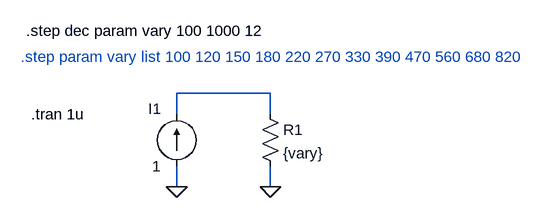
[diagram p0: schematic StepVal.asc]
StepVal.asc, the LTspice schematic file:
Version 4
SHEET 1 1128 680
WIRE -512 320 -512 288
WIRE -512 208 -512 176
WIRE -512 176 -368 176
WIRE -368 176 -368 208
WIRE -368 288 -368 320
FLAG -512 320 0
FLAG -368 320 0
SYMBOL current -512 288 R180
WINDOW 0 24 88 Left 0
WINDOW 3 24 0 Left 0
SYMATTR InstName I1
SYMATTR Value 1
SYMBOL res -384 192 R0
SYMATTR InstName R1
SYMATTR Value {vary}
TEXT -736 208 Left 0 !.tran 1u
TEXT -752 120 Left 0 ;.step param vary list 100 120 150 180 220 270 330 390 470 560 680 820
TEXT -744 80 Left 0 !.step dec param vary 100 1000 12

The netlist it stands for:
* StepVal.asc
I1 0 N001 1
R1 N001 0 {vary}
.tran 1u
* .step param vary list 100 120 150 180 220 270 330 390 470 560 680 820
.step dec param vary 100 1000 12
.backanno
.end